# EAGLE board AuxTalon_LoadSwitch (EAGLE 9.6.2)
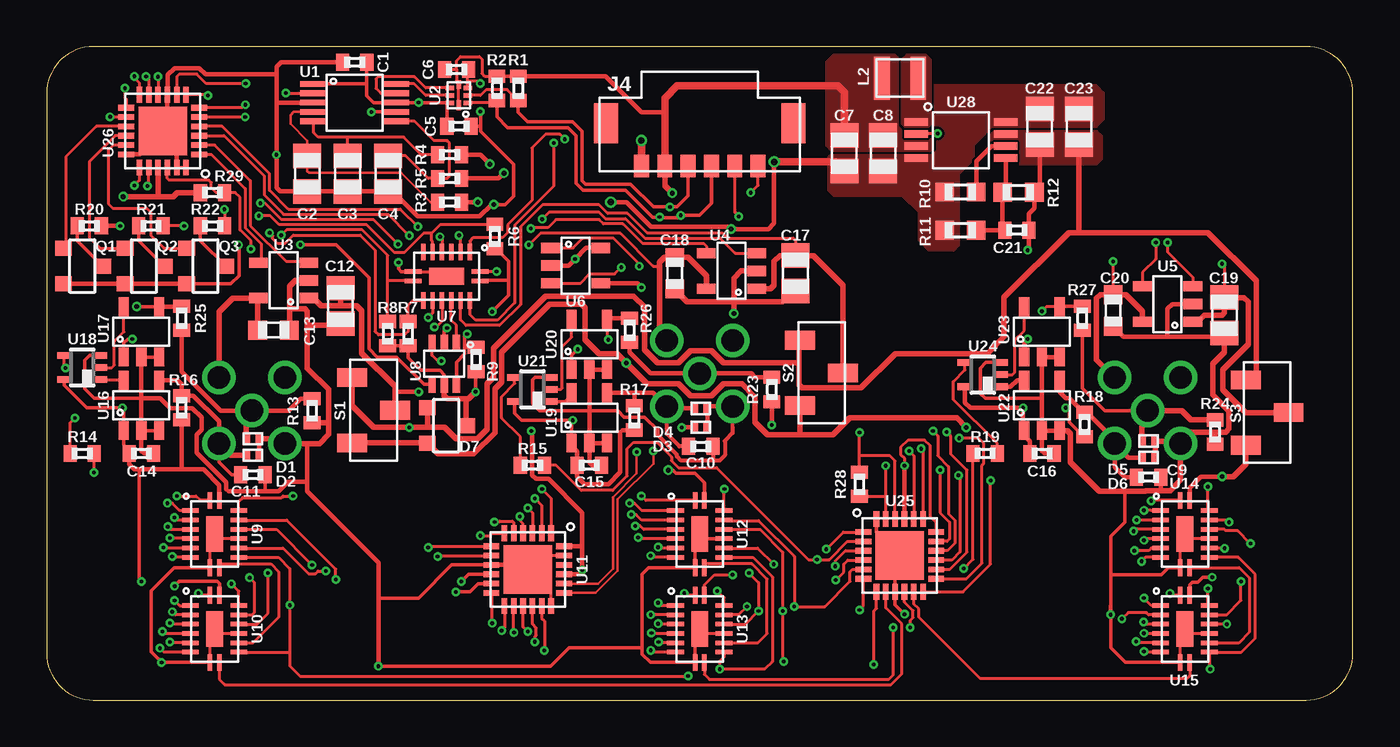
[diagram p2: board, top side]
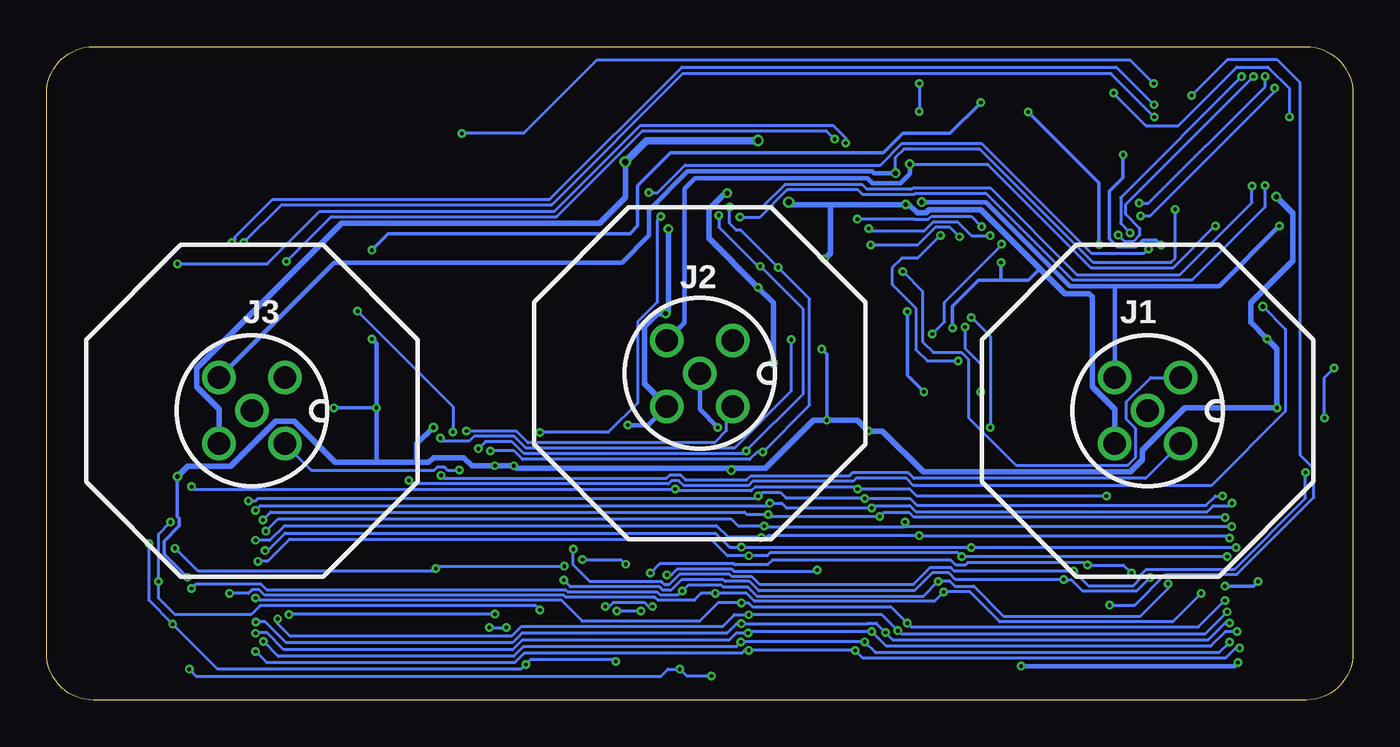
[diagram p3: board, bottom side, seen from below]

Size 70 x 35 mm. Coordinates in mm from the lower left corner, seen from the top.
Outline: 0,32.5 0,2.5 arc90 2.5,0 67.5,0 arc90 70,2.5 70,32.5 arc90 67.5,35 2.5,35 arc90 0,32.5
Copper layers (1*16): Top 0.035559375mm / dielectric 1.6mm / Bottom 0.035559375mm
Design rules "jlcpcb-2layer": minimum track width 5mil, minimum drill 0.2mm, track to track 5mil, track to pad 6mil, pad to pad 5mil, via to via 6mil, smd to smd 5mil, copper to edge 15mil, drill to drill 6mil, minimum pad ring 5mil, minimum via ring 5mil, stop-mask expansion 2.5mil, vias tented up to drill 0mil, thermal gap 10mil

## Footprints (pad centres in the part's own frame; a part is rotated, then mirrored left to right if it is on the bottom)
C0402 = smd 0.7 x 0.9: 1 -0.65,0; 2 0.65,0
C0805 = smd 1.3 x 1.5: 1 -0.95,0; 2 0.95,0
C0603 = smd 1 x 1: 1 -0.85,0; 2 0.85,0
D0402 = smd 0.4 x 0.7: 1 -0.35,0; 2 0.35,0
SOT23-3 = smd 0.8 x 0.9: 1 -0.95,-1; 2 0.95,-1; 3 0,1.1
1X05_M12_TE_T41410 = drill 1.2: 1 1.768,1.768; 2 -1.768,1.768; 3 -1.768,-1.768; 4 1.768,-1.768; 5 0,0
1X06_MICROLOCKPLUS = smd 0.8 x 1.2: 1 -3.125,-0.6; 2 -1.875,-0.6; 3 -0.625,-0.6; 4 0.625,-0.6; 5 1.875,-0.6; 6 3.125,-0.6 | smd 1.3 x 2.15: BODY@1 -5.025,1.695; BODY@2 5.025,1.695
WE-MAPI(2.5X2) = smd 0.85 x 2.3: P$1 -0.975,0; P$2 0.975,0
R0402 = smd 0.7 x 0.9: 1 -0.65,0; 2 0.65,0
R0603 = smd 1 x 1: 1 -0.85,0; 2 0.85,0
CAS-120A1 = smd 1 x 1.6: 1 -1.75,-1.15; 2 0,1.15; 3 1.75,-1.15
VSSOP_10 = smd 0.3 x 1.45: 1 -1,-2.2; 2 -0.5,-2.2; 3 0,-2.2; 4 0.5,-2.2; 5 1,-2.2; 6 1,2.2; 7 0.5,2.2; 8 0,2.2; 9 -0.5,2.2; 10 -1,2.2
UQFN-8_1.4X1.2 = smd 0.55 x 0.25: 1 -0.53,0 | smd 0.25 x 0.45: 2 -0.4,-0.475; 3 0,-0.475; 4 0.4,-0.475; 6 0.4,0.475; 7 0,0.475; 8 -0.4,0.475 | smd 0.45 x 0.25: 5 0.58,0
SOT23-5 = smd 0.55 x 1: 1 -0.95,-1.35; 2 0,-1.35; 3 0.95,-1.35; 4 0.95,1.35; 5 -0.95,1.35
VQFN-16 = smd 0.9 x 0.24: 1 -1.8,-0.25; 8 1.8,-0.25; 9 1.8,0.25; 16 -1.8,0.25 | smd 0.24 x 0.9: 2 -1.25,-1.3; 3 -0.75,-1.3; 4 -0.25,-1.3; 5 0.25,-1.3; 6 0.75,-1.3; 7 1.25,-1.3; 10 1.25,1.3; 11 0.75,1.3; 12 0.25,1.3; 13 -0.25,1.3; 14 -0.75,1.3; 15 -1.25,1.3 | smd 1.9 x 0.9: EP 0,0
DCK_R-PDSO-G6 = smd 0.4 x 0.9: 1 -0.65,-1.1; 2 0,-1.1; 3 0.65,-1.1; 4 0.65,1.1; 5 0,1.1; 6 -0.65,1.1
QFN24 = smd 0.85 x 0.3: 1 -1.95,1.25; 2 -1.95,0.75; 3 -1.95,0.25; 4 -1.95,-0.25; 5 -1.95,-0.75; 6 -1.95,-1.25; 13 1.95,-1.25; 14 1.95,-0.75; 15 1.95,-0.25; 16 1.95,0.25; 17 1.95,0.75; 18 1.95,1.25 | smd 0.3 x 0.85: 7 -1.25,-1.95; 8 -0.75,-1.95; 9 -0.25,-1.95; 10 0.25,-1.95; 11 0.75,-1.95; 12 1.25,-1.95; 19 1.25,1.95; 20 0.75,1.95; 21 0.25,1.95; 22 -0.25,1.95; 23 -0.75,1.95; 24 -1.25,1.95 | smd 2.6 x 2.6: EP 0,0
DCK_R-PDSO-G5 = smd 0.35 x 0.8: 1 -0.65,-0.95; 2 0,-0.95; 3 0.65,-0.95; 4 0.65,0.95; 5 -0.65,0.95
MSOP_8 = smd 1.26 x 0.4: 1 -2.4,0.975; 2 -2.4,0.325; 3 -2.4,-0.325; 4 -2.4,-0.975; 5 2.4,-0.975; 6 2.4,-0.325; 7 2.4,0.325; 8 2.4,0.975

## Placement (x,y rotation side)
C1  0.1uF  [C0402]  16.51,34.16 180 top
C2  0.1uF  [C0805]  13.97,28.19 270 top
C3  0.1uF  [C0805]  16.13,28.19 270 top
C4  0.1uF  [C0805]  18.29,28.19 270 top
C5  0.1uF  [C0402]  22.1,30.73 0 top
C6  0.1uF  [C0402]  21.97,33.78 0 top
C7  10uF  [C0805]  42.75,29.29 270 top
C8  10uF  [C0805]  44.83,29.29 270 top
C9  47nF  [C0402]  59.05,11.94 0 top
C10  47nF  [C0402]  35.05,13.59 0 top
C11  47nF  [C0402]  11.05,12.06 0 top
C12  10uF  [C0805]  15.75,21.11 270 top
C13  10uF  [C0603]  12.16,19.81 0 top
C14  0.1uF  [C0402]  5.08,13.21 0 top
C15  0.1uF  [C0402]  29.08,12.57 0 top
C16  0.1uF  [C0402]  53.34,13.21 0 top
C17  10uF  [C0805]  40.13,22.86 270 top
C18  10uF  [C0603]  33.66,22.86 270 top
C19  10uF  [C0805]  63.12,20.61 270 top
C20  10uF  [C0603]  57.15,20.86 270 top
C21  [C0402]  52,25.17 180 top
C22  22uF  [C0805]  53.22,30.7 90 top
C23  22uF  [C0805]  55.33,30.7 90 top
D1  6V  [D0402]  11.05,14 180 top
D2  6V  [D0402]  11.05,13.11 180 top
D3  6V  [D0402]  35.05,14.61 180 top
D4  6V  [D0402]  35.05,15.62 180 top
D5  6V  [D0402]  59.05,13.88 180 top
D6  6V  [D0402]  59.05,12.99 180 top
D7  [SOT23-3]  21.41,14.7 270 top
J1  CONN_AUX_M12_REMOTE  [1X05_M12_TE_T41410]  11,15.5 90 top
J2  CONN_AUX_M12_REMOTE  [1X05_M12_TE_T41410]  35,17.5 90 top
J3  CONN_AUX_M12_REMOTE  [1X05_M12_TE_T41410]  59,15.5 90 top
J4  CONN_TALON_REMOTE  [1X06_MICROLOCKPLUS]  35,29.21 0 top
L2  4.7uH  [WE-MAPI(2.5X2)]  45.73,33.31 0 top
Q1  2N7002  [SOT23-3]  1.91,23.24 270 top
Q2  2N7002  [SOT23-3]  5.21,23.24 270 top
Q3  2N7002  [SOT23-3]  8.51,23.24 270 top
R1  10k  [R0402]  25.27,32.77 90 top
R2  10k  [R0402]  24.13,32.77 90 top
R3  10k  [R0402]  21.59,26.67 0 top
R4  10k  [R0402]  21.59,29.21 0 top
R5  10k  [R0402]  21.59,27.94 0 top
R6  100k  [R0402]  24.02,24.83 270 top
R7  100k  [R0402]  19.37,19.63 270 top
R8  100k  [R0402]  18.28,19.63 270 top
R9  100k  [R0402]  23.01,18.24 270 top
R10  100k  [R0603]  48.97,27.22 0 top
R11  100k  [R0603]  48.97,25.17 0 top
R12  750k  [R0603]  52.08,27.2 0 top
R13  100k  [R0402]  14.22,15.49 90 top
R14  1k  [R0402]  1.91,13.21 0 top
R15  1k  [R0402]  26.04,12.57 0 top
R16  10k  [R0402]  7.24,15.65 270 top
R17  10k  [R0402]  31.5,15.11 270 top
R18  10k  [R0402]  55.63,14.76 270 top
R19  1k  [R0402]  50.29,13.21 180 top
R20  10k  [R0402]  2.29,25.4 0 top
R21  10k  [R0402]  5.59,25.4 0 top
R22  10k  [R0402]  8.89,25.4 0 top
R23  100k  [R0402]  38.86,16.64 90 top
R24  100k  [R0402]  62.61,14.35 90 top
R25  1k  [R0402]  7.24,20.45 90 top
R26  1k  [R0402]  31.24,19.81 90 top
R27  1k  [R0402]  55.5,20.45 90 top
R28  100k  [R0402]  43.56,11.56 270 top
R29  100k  [R0402]  8.89,27.18 180 top
S1  SPDTCAS-120A1  [CAS-120A1]  17.53,15.53 270 top
S2  SPDTCAS-120A1  [CAS-120A1]  41.53,17.53 270 top
S3  SPDTCAS-120A1  [CAS-120A1]  65.41,15.4 270 top
U1  ADS1115  [VSSOP_10]  16.51,32 270 top
U2  FXMAR2102UMLP  [UQFN-8_1.4X1.2]  22.09,32.39 90 top
U3  MIC2090-2  [SOT23-5]  12.7,22.48 90 top
U4  MIC2090-2  [SOT23-5]  36.7,22.99 90 top
U5  MIC2090-2  [SOT23-5]  60.07,21.21 90 top
U6  AT24MAC602SOT23  [SOT23-5]  28.35,23.27 270 top
U7  74HC4852  [VQFN-16]  21.43,22.7 180 top
U8  SN74LVC1G3157SC70  [DCK_R-PDSO-G6]  21.31,18.01 180 top
U9  [VQFN-16]  9,8.89 270 top
U10  [VQFN-16]  9,3.81 270 top
U11  PCAL9535AQFN  [QFN24]  25.78,6.99 270 top
U12  [VQFN-16]  35,8.89 270 top
U13  [VQFN-16]  35,3.81 270 top
U14  [VQFN-16]  61,8.89 270 top
U15  [VQFN-16]  61,3.81 270 top
U16  MAX9064  [SOT23-5]  5.08,15.78 0 top
U17  MAX9064  [SOT23-5]  5.08,19.72 0 top
U18  SN74AUP1T87  [DCK_R-PDSO-G5]  1.91,17.81 90 top
U19  MAX9064  [SOT23-5]  29.08,15.11 0 top
U20  MAX9064  [SOT23-5]  29.08,19.05 0 top
U21  SN74AUP1T87  [DCK_R-PDSO-G5]  26.04,16.64 90 top
U22  MAX9064  [SOT23-5]  53.34,15.78 0 top
U23  MAX9064  [SOT23-5]  53.34,19.72 0 top
U24  SN74AUP1T87  [DCK_R-PDSO-G5]  50.16,17.43 90 top
U25  PCAL9535AQFN  [QFN24]  45.72,7.75 0 top
U26  PCAL9535AQFN  [QFN24]  6.22,30.48 180 top
U28  PAM2401MSOP  [MSOP_8]  49,30 0 top

## Tracks (layer width: path | path; a pad name or v marks a point on that pad's centre or on a via)
3V3  (via drill 0.2, 0.25)
  Top 0.152: 21.96,33.78 21.96,34.24 22.18,34.46 23.19,34.46 23.33,34.33 23.33,33.57 23.48,33.42 R2.2 | C6.1 21.96,33.78 | U13.16 35.25,6.17 35.79,6.71 v36.76,6.71 | U2.1 U2.5 22.09,33.07 21.96,33.19 21.96,33.78 | U25.23 44.97,10.92 | 44.97,10.92 44.97,12.54 v44.96,12.55 | U25.18 47.67,9.51 47.35,9.83 47.35,13.62 47.05,13.92 46.16,13.92 45.77,13.53 45.77,13.15 45.97,12.95 v45.97,12.55 | R28.2 43.58,10.92 44.97,10.92
  Top 0.2: U17.1 4.13,19.13 4.33,19.34 v4.59,19.34 | C14.1 4.43,13.38 4.13,13.68 U16.1 4.13,15.59 v4.06,15.65 2.16,15.65 0.95,16.86 U18.5 | v6.86,6.1 7.11,6.35 9.14,6.35 9.27,6.22 9.27,5.63 U10.16 | 4.95,12.35 4.95,6.48 v5.08,6.35 | U15.16 61.25,6.17 61.4,6.32 61.7,6.32 61.96,6.58 v62.47,6.58 | U20.1 28.13,18.47 v28.46,18.8 | U19.1 28.13,14.93 v28.19,14.99 25.45,14.99 25.09,15.35 U21.5 | R2.2 R1.2 | v54.61,15.65 54.82,15.45 54.82,14.89 55.59,14.11 R18.2 | U12.16 35.25,11.64 34.75,12.14 33.73,12.14 33.56,12.31 v33.31,12.31
  Top 0.254: R16.2 7.24,12.35 | C14.1 4.43,12.62 4.7,12.35 4.95,12.35 7.24,12.35 | U19.1 28.13,13.64 28.43,13.34 C15.1 28.43,11.95 28.83,11.56 30.1,11.56 30.73,12.19 30.73,14.34 30.86,14.46 R17.2 | C16.1 52.69,13.88 52.39,14.18 U22.1 52.32,14.5 v52.32,15.65 49.5,15.65 49.22,15.94 U24.5 | v52.58,19.34 52.39,19.15 U23.1 | v62.99,11.97 61.85,11.97 61.25,11.37 U14.16 | 28.7,8.26 v28.7,6.96 28.7,6.86 28.57,6.73 U11.21 | 28.7,8.26 28.7,10.03 26.89,11.84 26.22,11.84 26.01,12.05 26.01,14.41 v25.97,14.41 | U9.16 9.25,11.51 8.41,12.35 7.24,12.35 | R1.2 29.96,33.42 31.88,31.5 33.12,31.5 | U6.4 31.66,22.32 v31.88,22.1 | v45.97,12.55 U25.21 | U11.24 28.68,8.23 28.7,8.26
  Top 0.305: v62.99,11.97 63.59,11.97 64.25,12.63 S3.3 | v33.53,27.15 33.12,27.56 J4.2 | S1.3 20.38,13.78 D7.2 20.97,13.18 22.88,13.18 24.03,14.33 24.03,16.66 24.38,17.01 24.38,18.64 26.95,21.21 28.66,21.21 28.84,21.03 28.84,19.29 29.59,18.54 30.57,18.54 v31.06,18.06 32.18,16.94 33.86,16.94 34.5,16.3 35.63,16.3 36.27,16.94 37.27,16.94 37.97,16.23 37.97,14.87 38.64,14.2 40.39,14.2 | v49.28,14.61 48.77,15.11 43.05,15.11 42.14,14.2 40.39,14.2 | S2.3 40.38,14.21 40.39,14.2 | R29.2 6.99,27.18 6.77,26.96 5.97,26.96 | v4.1,26.96 5.97,26.96 | U26.21 5.97,26.97 5.97,26.96
  Top 0.406: J4.2 33.12,31.5 33.12,32.24 33.78,32.89 42.42,32.89 42.75,32.56 C7.1
  Bottom 0.152: v36.76,6.71 36.51,6.71 36.21,7.01 33.28,7.01 33.18,6.91 28.75,6.91 v28.7,6.96
  Bottom 0.2: v6.86,6.1 5.33,6.1 v5.08,6.35 | v28.46,18.8 28.19,18.53 v28.19,14.99 | v62.47,6.58 63.7,7.82 63.7,8.52 62.89,9.33 62.89,9.72 62.99,9.82 v62.99,11.97 | v54.61,15.65 v52.32,15.65
  Bottom 0.254: v52.58,19.34 52.32,19.08 v52.32,15.65 52.32,12.73
  Bottom 0.305: v49.28,14.61 50.16,13.72 50.16,12.73 | v31.06,18.06 31.06,21.28 v31.88,22.1 34.51,24.73 34.51,26.3 33.66,27.15 v33.53,27.15 | 33.4,12.42 31.48,12.42 28.91,14.99 v28.19,14.99 26.54,14.99 v25.97,14.41 25.2,14.41 23.02,12.22 11.92,12.22 11.28,12.86 11.28,13.38 9.02,15.65 v4.06,15.65 4.06,18.81 v4.59,19.34 5.47,20.23 5.47,21.27 3.21,23.54 3.21,26.07 v4.1,26.96 | 33.4,12.42 44.83,12.42 v44.96,12.55 v45.97,12.55 47.21,12.55 47.65,12.99 49.28,12.99 49.53,12.73 50.16,12.73 | v33.31,12.31 33.31,12.33 33.4,12.42 | 50.16,12.73 52.32,12.73 54.53,12.73 56.73,14.94 57.73,14.94 60.14,12.53 62.43,12.53 v62.99,11.97
  pour Top (no thermals): 41.78,34.16 41.78,29.72 42.04,29.46 47.37,29.46 47.5,29.59 47.5,30.23 47.37,30.35 45.97,30.35 45.59,30.73 45.59,34.42 45.34,34.67 42.29,34.67
5V  (via drill 0.2)
  Top 0.152: U7.11 20.68,20.73 v20.45,20.49
  Top 0.2: C1.1 17.16,33.02 | 17.16,33.02 17.16,32.37 17.53,32 U1.8 v19.94,32 21.46,32 | 17.16,33.02 17.14,33 U1.1 | U2.8 21.6,32 21.46,32 | C5.1 21.45,31.99 21.46,32
  Top 0.254: C22.1 53.22,27.49 R12.2 52.93,26.34 52.65,26.06 C21.1 52.65,24.17 v52.58,24.1
  Top 0.305: S1.1 16.38,15.76 17.53,14.61 v19.43,14.61 20.45,14.61 | C23.1 55.33,25.04 | 20.45,14.61 21.32,14.61 21.93,13.99 23.08,13.99 23.6,14.51 23.6,16.94 23.95,17.3 23.95,18.84 26.75,21.64 31.45,21.64 32.03,21.06 32.03,18.77 32.73,18.06 33.86,18.06 34.5,18.7 35.63,18.7 36.27,18.06 40.27,18.06 40.3,18.03 | D7.1 20.41,14.65 20.45,14.61 | 40.3,18.03 40.3,16.9 40.48,16.72 43.65,16.72 45.48,18.56 50.41,18.56 51.31,19.46 51.31,21.57 54.78,25.04 55.33,25.04 | 55.33,25.04 62.23,25.04 64.82,22.45 64.82,17.46 64.51,17.15 S3.1 | S2.1 40.3,19.2 40.3,18.03
  Bottom 0.152: v20.45,20.49 19.43,19.48 v19.43,14.61
  Bottom 0.2: v52.58,24.1 51.69,24.99 38.74,24.99 38.33,25.4 38.33,27.54 36.55,29.31 25.15,29.31 24.11,30.35 21.59,30.35 v19.94,32
  pour Top (no thermals): 50.8,30.48 56.26,30.48 56.52,30.23 56.52,28.96 56.26,28.7 50.8,28.7 50.55,28.96 50.55,30.23
5V_EN  (via drill 0.2)
  Top 0.152: v47.75,30.35 47.72,30.32 U28.2 | v10.67,33.02 8.55,33.02 8.04,33.53 7.11,33.53 6.97,33.39 U26.8
  Bottom 0.152: v47.75,30.35 44.45,30.35 40.51,34.29 11.94,34.29 v10.67,33.02
!OVF1
  Top 0.152: U10.9 9.25,1.12 9.55,0.82 45.25,0.82 45.83,1.4 45.83,4.08 44.97,4.94 U25.8
!OVF2  (via drill 0.2)
  Top 0.152: v45.37,3.88 45.37,1.34 45.13,1.1 35.52,1.1 35.25,1.38 U13.9 | v46.28,3.88 46.28,4.26 46.43,4.41 46.43,4.79 45.97,5.25 U25.10
  Bottom 0.152: v46.28,3.88 v45.37,3.88
!OVF3
  Top 0.152: U15.9 61.25,1.31 61.09,1.14 50.04,1.14 46.74,4.45 46.74,4.88 46.47,5.14 U25.11
!PORT1_FAULT
  Top 0.152: U26.1 8.81,29.23 10.64,27.4 10.64,25.3 11.49,24.45 11.49,23.57 U3.4
!PORT2_FAULT  (via drill 0.2)
  Top 0.152: v25.94,25.25 25.99,25.3 26.87,25.3 27.3,25.73 29.61,25.73 29.83,25.51 30.89,25.51 31.94,24.46 35.21,24.46 35.35,24.32 U4.4 | v19.43,24.87 18.29,26.02 12.7,26.02 11.66,27.06 11.66,28.08 9.51,30.23 U26.3
  Bottom 0.152: v19.43,24.87 20.45,24.87 21.2,25.63 22.47,25.63 22.95,25.15 25.84,25.15 v25.94,25.25
!PORT3_FAULT  (via drill 0.2)
  Top 0.152: v10.64,31.23 U26.5 | v59.44,24.51 59.44,23.62 58.72,22.91 U5.4
  Bottom 0.152: v59.44,24.51 57.4,26.54 42.93,26.54 35.92,33.55 12.96,33.55 v10.64,31.23
!RST  (via drill 0.2)
  Top 0.152: U9.10 12.43,7.64 13.03,7.04 v13.03,5.08 13.03,2.54 | 13.03,2.54 13.03,1.83 13.58,1.28 v34.37,1.28 | U12.10 37.84,7.64 38.89,6.59 38.89,2.06 38.48,1.65 v36.07,1.65 36.07,2.07 36.3,2.31 U13.10 | 13.03,2.54 13.01,2.56 U10.10 | v62.36,1.65 62.3,1.71 U15.10 64.03,2.56 64.77,3.3 64.77,6.73 63.86,7.64 U14.10 | v8.64,32.38 8.59,32.43 U26.7
  Bottom 0.152: v34.37,1.28 35.7,1.28 v36.07,1.65 36.7,1.65 37.08,1.27 61.98,1.27 v62.36,1.65 | v13.03,5.08 11.69,5.08 10.05,6.73 6.22,6.73 2.08,10.86 2.08,12.38 2.82,13.12 2.82,33.07 4.04,34.29 6.73,34.29 v8.64,32.38
ACTRL1
  Top 0.152: U26.15 2.66,30.73 1.03,29.1 1.03,24.32 Q1.1
ACTRL2
  Top 0.152: U26.16 3.67,30.23 2.29,28.84 2.29,24.77 2.86,24.19 Q2.1
ACTRL3
  Top 0.152: U26.17 3.57,29.73 3.3,29.46 3.3,26.59 3.54,26.35 5.36,26.35 5.59,26.13 5.59,24.89 6.29,24.19 Q3.1
ADC_INT  (via drill 0.2)
  Top 0.152: v12.83,32.51 14.3,32.51 U1.2 | v3.4,31.24 4.26,31.24 U26.14
  Bottom 0.152: v3.4,31.24 3.4,32.76 4.55,33.91 6.22,33.91 9.36,30.77 11.09,30.77 v12.83,32.51
AIN1  (via drill 0.2, 0.25)
  Top 0.254: R3.2 v23.11,26.67 | v3.94,25.4 R20.2
  Bottom 0.254: v23.11,26.67 19.66,26.67 15.17,22.18 12.7,22.18 | v3.94,25.4 7.16,22.18 12.7,22.18 | 12.7,22.18 12.77,22.11 J1.4
AIN1_FILT
  Top 0.127: R3.1 20.57,26.67 19,28.24 14.05,28.24 13.97,28.32 C2.1 13.97,29.97 13.08,30.86 13.08,31.34 13.25,31.5 U1.4
AIN2  (via drill 0.2, 0.25)
  Top 0.152: v7.37,25.4 R21.2
  Top 0.254: v23.75,28.7 23.75,28.72 23.26,29.21 R4.2
  Bottom 0.152: v23.75,28.7 19.58,28.7 14.04,23.17 9.63,23.17 7.4,25.4 v7.37,25.4
  Bottom 0.254: J2.4 35.81,20.22 35.81,27.39 35.26,27.94 26,27.94 25.75,27.69 24.26,27.69 23.75,28.19 v23.75,28.7
AIN2_FILT
  Top 0.152: R4.1 20.07,29.21 19.13,30.15 16.13,30.15 | U1.5 14.31,30.39 14.55,30.15 16.13,30.15 | C3.1 16.13,30.15
AIN3  (via drill 0.2, 0.25)
  Top 0.152: v9.53,26.29 9.54,26.27 R22.2
  Top 0.254: v24.51,28.22 24.23,27.94 R5.2
  Bottom 0.152: v24.51,28.22 24.51,29.07 24.04,29.54 20.02,29.54 13.93,23.45 9.75,23.45 9.53,23.67 v9.53,26.29
  Bottom 0.254: J3.4 54.6,23.43 39.18,23.43 37.72,24.89 37.72,26.25 35.65,28.32 25.76,28.32 25.65,28.22 v24.51,28.22
AIN3_FILT
  Top 0.152: C4.1 19.24,29.14 20.45,27.94 R5.1 21.46,27.94 21.59,28.07 21.59,29.84 21.46,29.97 20.76,29.97 19.73,31 U1.6
BUS_SENSE  (via drill 0.2)
  Top 0.2: U8.4 20.22,16.91 18.75,18.37 17.72,18.37 17.28,18.82 17.28,22.62 15.51,24.39 v13.6,24.39 | v17.4,31.5 v17.41,31.5 U1.7
  Bottom 0.2: v13.6,24.39 13.6,27.7 v17.4,31.5
C0  (via drill 0.2)
  Top 0.152: U12.15 36.3,11.28 v36.32,11.3 | U14.15 62.23,10.21 v62.23,11.43 | U9.15 10.3,10.65 10.5,10.85 12.58,10.85 12.66,10.92 v13.21,10.92 | v26.54,11.3 27.03,10.81 U11.1
  Bottom 0.152: v62.23,11.43 62.1,11.3 v36.32,11.3 36.22,11.2 32.24,11.2 32.01,11.43 26.67,11.43 v26.54,11.3 23.75,11.3 23.37,10.92 v13.21,10.92
C1  (via drill 0.2)
  Top 0.152: v6.99,10.92 8.01,10.92 8.24,10.69 U9.1 | U12.1 32.11,10.69 v31.88,10.92 | U14.1 59.2,10.69 v59.18,10.67 | v26.16,10.79 26.53,10.43 U11.2
  Bottom 0.152: v59.18,10.67 58.81,10.67 58.68,10.79 32,10.79 v31.88,10.92 31.68,11.12 30.68,11.12 30.35,10.79 v26.16,10.79 23.73,10.79 23.36,10.42 7.87,10.42 7.37,10.92 v6.99,10.92
C2  (via drill 0.2)
  Top 0.152: U9.2 7.13,10.14 6.73,10.54 v6.48,10.54 | U12.2 31.9,10.14 31.5,10.54 v31.24,10.54 | U14.2 59.2,10.14 59.18,10.16 v58.8,10.16 | v25.78,10.29 26.03,10.04 U11.3
  Bottom 0.152: v6.48,10.54 6.6,10.41 7.48,10.41 7.81,10.09 23.42,10.09 23.75,10.41 25.65,10.41 v25.78,10.29 30.35,10.29 30.61,10.54 v31.24,10.54 31.37,10.41 58.55,10.41 v58.8,10.16
C3  (via drill 0.2)
  Top 0.152: U9.3 6.99,9.64 v6.85,9.77 | U12.3 31.88,9.64 31.59,9.94 v31.33,9.94 | U14.3 v58.42,9.64 v58.41,9.65 | U11.4 25.53,9.44 25.36,9.62 v25.36,9.83
  Bottom 0.152: v58.41,9.65 58,10.06 32.6,10.06 32.47,9.94 v31.33,9.94 31.23,9.83 v25.36,9.83 25.16,10.03 23.76,10.03 23.54,9.81 6.88,9.81 v6.85,9.77
C4  (via drill 0.2)
  Top 0.152: U9.4 6.63,9.14 v6.49,9.28 | U12.4 31.99,9.14 31.8,9.33 v31.55,9.33 | U14.4 58.35,9.14 v58.25,9.04 | v24,9.54 24.23,9.54 24.29,9.59 24.95,9.59 25.03,9.51 U11.5
  Bottom 0.152: v58.25,9.04 57.58,9.71 33.33,9.71 32.94,9.33 v31.55,9.33 31.5,9.28 24,9.28 | v6.49,9.28 24,9.28 | v24,9.54 24,9.28
C5  (via drill 0.2)
  Top 0.152: U9.5 7.66,8.68 v6.6,8.68 | U12.5 31.76,8.64 v31.69,8.71 | U14.5 58.88,8.64 v58.8,8.56 | v23.24,8.8 23.75,8.8 23.88,8.94 U11.6
  Bottom 0.152: v6.6,8.68 6.73,8.8 v23.24,8.8 31.33,8.8 31.43,8.71 v31.69,8.71 33.47,8.71 34.11,9.35 57.25,9.35 58.04,8.56 v58.8,8.56
C6  (via drill 0.2)
  Top 0.152: U9.6 6.28,8.14 v6.26,8.16 | U14.6 59.19,8.14 59.05,8 v58.29,8 | v20.45,8.16 20.52,8.23 U11.7 | U12.6 32.81,8.14 v32.77,8.18
  Bottom 0.152: v6.26,8.16 v20.45,8.16 20.47,8.18 v32.77,8.18 33.4,8.18 34.16,8.95 57.22,8.95 58.17,8 v58.29,8
C7  (via drill 0.2)
  Top 0.152: U9.7 6.78,7.64 v6.73,7.68 | U12.7 32.45,7.64 v32.37,7.73 | U14.7 58.88,7.64 v58.67,7.43 | v20.95,7.68 21.01,7.74 U11.8
  Bottom 0.152: v6.73,7.68 v20.95,7.68 21.16,7.88 31.23,7.88 31.39,7.73 v32.37,7.73 33.51,7.73 34.4,8.62 56.98,8.62 58.17,7.43 v58.67,7.43
C8  (via drill 0.2)
  Top 0.152: U13.15 36.3,5.48 v35.94,5.84 | U10.15 10.3,5.83 v9.91,6.22 | U15.15 62.23,5.13 v62.23,5.97
  Top 0.2: U11.10 22.61,6.74 v22.23,6.35
  Bottom 0.152: v9.91,6.22 9.91,5.97 11.4,4.47 18.69,4.47 20.32,6.1 21.34,6.1 21.59,6.35 v22.23,6.35 23.01,5.57 31.94,5.57 32.45,6.07 33.76,6.07 33.86,6.17 35.61,6.17 v35.94,5.84 36.17,5.61 37.1,5.61 37.27,5.78 42.07,5.78 42.18,5.89 58.19,5.89 58.5,6.2 62,6.2 v62.23,5.97
C9  (via drill 0.2)
  Top 0.152: U13.1 34.27,5.61 v34.16,5.71 | U10.1 8.23,5.61 v8.13,5.71 | U15.1 60.3,5.61 v60.2,5.71
  Top 0.2: U11.11 23.13,6.24 22.68,5.79 v21.93,5.79
  Bottom 0.152: v8.13,5.71 9.65,4.19 18.92,4.19 20.52,5.79 v21.93,5.79 22.43,5.29 32.06,5.29 32.49,5.71 v34.16,5.71 34.92,5.71 35.31,5.33 37.22,5.33 37.39,5.5 42.18,5.5 42.29,5.61 58.31,5.61 58.61,5.92 58.99,5.92 59.19,5.71 v60.2,5.71
C10  (via drill 0.2)
  Top 0.152: U10.2 7.13,5.06 v6.86,5.33 | U13.2 32.91,5.06 v32.77,5.21 | U15.2 59.2,5.06 v58.8,5.46 | U11.12 23.83,4.16 v23.88,4.12
  Bottom 0.152: v58.8,5.46 58.67,5.46 58.55,5.33 42.41,5.33 41.29,4.21 35.02,4.21 34.03,5.21 v32.77,5.21 32.38,5.21 32.18,5.01 24.77,5.01 v23.88,4.12 23.67,3.91 8.28,3.91 v6.86,5.33
C11  (via drill 0.2)
  Top 0.152: U10.3 6.9,4.56 v6.73,4.73 | U13.3 v32.39,4.56 v32.38,4.57 | U15.3 59.06,4.56 58.94,4.69 57.96,4.69 v57.62,4.35 | U11.13 24.53,3.86 v24.38,3.71
  Bottom 0.152: v6.73,4.73 7.9,3.56 24.23,3.56 v24.38,3.71 25.24,4.57 v32.38,4.57 33.14,4.57 33.78,3.93 44.57,3.93 45.08,3.42 56.95,3.42 57.62,4.09 v57.62,4.35
C12  (via drill 0.2)
  Top 0.152: U10.4 6.67,4.06 v6.6,4.12 | U13.4 32.79,4.06 v32.77,4.09 | U15.4 58.91,4.06 v58.79,4.18 | v25.05,3.61 25.03,3.63 U11.14
  Bottom 0.152: v6.6,4.12 6.86,4.12 7.75,3.23 24.67,3.23 v25.05,3.61 25.55,4.12 25.97,4.12 26,4.09 v32.77,4.09 33.02,4.09 33.53,3.58 44.53,3.58 45.04,3.07 57.17,3.07 58.28,4.18 v58.79,4.18
C13  (via drill 0.2)
  Top 0.152: U10.5 6.31,3.56 v6.2,3.66 | U13.5 32.44,3.56 v32.41,3.58 | U15.5 58.82,3.56 v58.8,3.58 | v25.78,3.66 25.53,3.91 U11.15
  Bottom 0.152: v6.2,3.66 6.84,3.66 7.6,2.9 25.02,2.9 v25.78,3.66 32.33,3.66 v32.41,3.58 33.05,3.58 33.43,3.2 44.51,3.2 45.02,2.69 57.3,2.69 58.19,3.59 58.78,3.59 v58.8,3.58
C14  (via drill 0.2)
  Top 0.152: U10.6 6.65,3.06 v6.6,3.1 | U13.6 32.84,3.06 v32.79,3.1 | U15.6 58.46,3.06 v58.38,3.14 | U11.16 26.03,4.06 26.24,3.85 26.24,3.48 26.16,3.4 v26.16,3.12
  Bottom 0.152: v58.38,3.14 57.59,2.34 44.98,2.34 44.47,2.85 33.05,2.85 v32.79,3.1 32.58,3.1 32.57,3.12 v26.16,3.12 25.59,2.55 7.16,2.55 v6.6,3.1
C15  (via drill 0.2)
  Top 0.152: U10.7 6.29,2.56 v6.08,2.77 | U13.7 32.48,2.56 v32.38,2.66 | U15.7 58.84,2.56 v58.8,2.6 | U11.17 26.53,4.38 26.67,4.24 v26.67,2.65
  Bottom 0.152: v6.08,2.77 6.29,2.77 6.8,2.27 26.29,2.27 v26.67,2.65 26.68,2.66 v32.38,2.66 32.59,2.66 32.73,2.52 44.4,2.52 44.91,2.01 58.21,2.01 v58.8,2.6
COUNT_EN1  (via drill 0.2)
  Top 0.152: v10.88,6.55 11.13,6.3 11.13,4.69 11,4.56 U10.14 | v15.49,6.45 15.49,7.02 12.87,9.64 U9.14 | v42.29,6.42 v42.29,6.43 42.72,6.85 42.72,7.29 42.93,7.5 U25.4
  Bottom 0.152: v10.88,6.55 11.59,5.84 14.49,5.84 15.1,6.45 v15.49,6.45 21.3,6.45 21.65,6.81 22.54,6.81 23.5,5.84 31.83,5.84 32.33,6.35 33.64,6.35 33.74,6.45 35.98,6.45 36.53,5.89 36.98,5.89 37.15,6.06 41.93,6.06 v42.29,6.42
COUNT_EN2  (via drill 0.2)
  Top 0.152: U12.14 36.32,9.62 38.15,9.62 40.07,7.7 v40.07,5 41.71,5 43.05,6.35 43.05,6.86 43.19,7 U25.5 | v37.53,5 37.09,4.56 U13.14
  Bottom 0.152: v40.07,5 39.85,5 39.63,5.22 37.96,5.22 37.74,5 v37.53,5
COUNT_EN3  (via drill 0.2)
  Top 0.152: U15.14 63.23,4.56 64.01,5.33 v64.01,6.35 | v63.37,9.53 63.26,9.64 U14.14 | v43.56,4.83 43.77,5.04 U25.6
  Bottom 0.152: v63.37,9.53 64.01,8.89 v64.01,6.35 64.01,5.46 63.12,4.57 59.05,4.57 58.56,5.05 43.79,5.05 v43.56,4.83
D1
  Top 0.254: R13.2 13.6,16.14 12.96,15.5 J1.5 9.33,15.5 7.24,17.59 R25.1
  Top 0.305: D1.2 10.7,15.2 J1.5
D1_SENSE  (via drill 0.2, 0.25)
  Top 0.152: U25.12 49.1,5.8 50.59,7.28 v50.59,11.76
  Top 0.2: U17.4 4.84,21.07 v4.83,21.08
  Top 0.254: R25.2 7.21,21.07 U17.4
  Bottom 0.152: v4.83,21.08 3.61,19.86 3.61,15.46 7.58,11.49 23.54,11.49 23.94,11.89 26.61,11.89 26.77,11.72 32.16,11.72 32.4,11.48 35.85,11.48 36.13,11.76 36.51,11.76 36.69,11.58 50.41,11.58 v50.59,11.76
D2  (via drill 0.2)
  Top 0.254: D3.2 v34.04,14.61 | R23.2 37.97,17.29 37.76,17.5 J2.5 32.37,17.5 31.24,18.63 R26.1
  Bottom 0.254: v34.04,14.61 35,15.57 J2.5
D2_SENSE  (via drill 0.2)
  Top 0.152: U20.4 30.03,19.37 v30.1,19.3 | U25.13 49.3,6.5 50.13,7.33 50.13,12.58 50.22,12.66 50.22,13.75 49.95,14.03 v48.9,14.03
  Top 0.254: R26.2 30.09,20.46 U20.4
  Bottom 0.152: v30.1,19.3 30.1,16.55 33.15,13.5 44.32,13.5 44.94,14.12 47.1,14.12 47.33,13.9 48.77,13.9 v48.9,14.03
D3
  Top 0.2: J3.5 56.7,15.5 55.5,16.7 R27.1
  Top 0.305: D5.2 58.7,15.21 J3.5 60.83,15.5 61.33,15 R24.2
D3_SENSE  (via drill 0.2)
  Top 0.152: U23.4 53.58,21.07 v53.34,20.83 | U25.14 48.4,7 49.32,7.92 49.32,12.32 48.44,13.2 48.44,14.15 v48.23,14.35
  Top 0.2: R27.2 54.32,21.1 U23.4
  Bottom 0.152: v53.34,20.83 48.23,15.72 v48.23,14.35
GND  (via drill 0.2, 0.25, 0.35)
  Top 0.152: U9.12 9.25,8.64 U9.EP 8.75,8.64 U9.8 | U10.8 8.75,3.56 U10.EP 9.25,3.56 U10.12 | U13.12 35.25,3.56 35.15,3.66 U13.EP | U15.8 60.75,3.56 U15.EP 61.25,3.56 U15.12 | U14.8 60.75,8.64 U14.EP 61.25,8.64 U14.12 | U2.4 22.56,33.15 | 22.56,33.15 22.56,33.72 C6.2 | v23.23,33.02 23.11,33.15 22.56,33.15 | v57.01,4.57 57.01,5.07 57.02,5.08 | U7.8 21.18,22.95 U7.EP | U11.23 26.53,7.74 U11.EP 25.91,6.86 27.03,5.74 U11.18 | U26.23 U26.24
  Top 0.2: U17.2 5.21,18.37 U17.3 | U16.2 U16.3 | U18.3 2.3,18.46 2.03,18.19 2.03,16.67 2.54,16.16 5.08,16.16 | U9.8 6.84,7.09 5.6,5.85 5.6,2.58 v6.16,2.01 U10.8 | 34.9,8.79 34.75,8.64 U12.8 32.26,7.09 31.9,6.73 31.9,2.79 | 34.9,8.79 U12.EP | U12.12 35.05,8.64 34.9,8.79 | 35.15,3.66 34.75,3.25 U13.8 32.35,2.01 31.9,2.46 31.9,2.79 | U14.8 60.12,7.09 59.73,6.71 57.05,6.71 57.02,6.73 | U15.8 57.81,2.01 57.02,2.79 57.02,5.08 57.02,6.73 | J2.3 36.77,14.59 | 32.76,14.45 32.05,15.16 30.94,15.16 30.61,15.49 29.08,15.49 26.42,15.49 26.04,15.88 26.04,17.14 26.18,17.29 U21.3 | 53.34,16.16 50.3,16.16 50.04,16.42 50.04,17.78 50.34,18.08 U24.3 | 31.9,2.79 27.99,2.79 27.01,1.81 v17.78,1.81 | U8.2 21.31,19.77 v21.45,19.92 | U7.8 19,22.95 18.86,23.09 v18.86,23.43 | v23.96,26.54 24.57,26.54 25.02,26.99 25.02,28.7 23.25,30.48 23.25,30.73 | 23.25,30.73 v23.25,31.53 | C11.2 11.7,11.19 11.68,11.18 | 17.78,5.46 19.94,5.46 21.71,7.24 U11.9 | 57.78,11.18 57.78,9.53 57.02,8.76 57.02,6.73 | v45.97,4.6 45.47,5.1 U25.9 45.47,7.5 U25.EP 44.47,9 U25.24 | v10.29,24.38 10.31,24.36 10.31,22.74 9.87,22.29 Q3.2 | C5.2 23.25,30.73
  Top 0.203: 36.77,14.59 36.77,14.3 36.35,13.89 36.35,13.11 36.07,12.83 35.69,12.83 | 35.69,12.83 34.01,12.83 33.78,13.05 33.78,13.15 32.76,14.18 32.76,14.45 | C10.2 35.7,12.84 35.69,12.83
  Top 0.254: 5.08,16.16 U16.2 5.08,13.35 5.22,13.21 C14.2 | 5.08,16.16 5.08,18.24 5.21,18.37 | 5.08,16.16 6.1,16.16 6.62,15.63 7.8,15.63 8.3,15.14 8.3,14.47 8.05,14.22 8.05,13.24 9.63,11.67 9.63,11.3 9.76,11.18 11.68,11.18 12.45,11.18 12.95,11.68 13.97,11.68 | U19.2 U19.3 | C15.2 29.23,12.57 29.08,12.71 U19.2 | U20.3 U20.2 29.08,15.49 U19.2 | U22.2 53.34,16.16 U23.2 U23.3 | U22.2 U22.3 | 33.66,22.23 C18.2 | v30.23,26.67 31.08,26.67 32.39,25.36 36.55,25.36 v36.68,25.23 38.68,25.23 38.99,25.54 v38.99,28.83 | v23.96,26.54 23.83,26.54 23.2,25.91 19.88,25.91 18.54,27.24 C4.2 C3.2 C2.2 12.51,27.24 12.32,27.43 v12.32,29.21 12.32,32 | U1.3 12.32,32 | D1.1 D2.1 | D3.1 D4.1 35.51,15.73 J2.3 | C19.2 62.93,19.46 60.07,19.46 | U6.2 27.97,23.27 v28.32,23.62 28.92,24.22 U6.5 | 13.97,11.68 13.97,11.18 17.78,7.37 17.78,5.46 v17.78,1.81 | 13.97,11.68 13.97,13.73 | v38.86,14.73 R23.1 | C9.2 59.7,11.22 59.69,11.21 | U11.9 25.53,7.24 25.91,6.86 | U22.2 53.34,13.34 53.47,13.21 C16.2 | 12.32,33.53 12.32,33.91 12.57,34.16 C1.2 | 12.32,33.53 8.51,33.53 8.18,33.86 6.85,33.86 6.48,33.48 U26.9 6.47,30.73 U26.EP | 12.32,32 12.32,33.53 | Q1.2 Q2.2 Q3.2 | U26.18 4.7,29.23 4.71,29.23 4.98,29.23 U26.EP | U26.23 6.97,29.73 U26.EP | U5.2 60.33,21.21 60.07,20.95 60.07,19.46 | C20.2 57.7,19.46 60.07,19.46
  Top 0.305: 36.83,21.34 39.44,21.34 40.01,21.91 C17.2 | v36.83,20.7 36.83,21.34 | C19.2 63.12,18.64 62.48,18 62.48,16.36 63.37,15.48 63.37,14.53 63.19,14.35 62.61,14.35 | D1.1 12.5,14 J1.3 13.97,13.73 14.62,13.73 15.11,14.22 15.11,14.86 | D6.1 D5.1 60.62,13.88 | 60.62,13.88 J3.3 60.77,11.77 60.21,11.21 59.69,11.21 58.91,11.21 58.88,11.18 57.78,11.18 56.41,11.18 54.86,12.73 54.86,14.26 54.69,14.43 U22.3 | 60.62,13.88 61.1,14.35 62.61,14.35 | R24.1 62.61,14.35 | 15.11,14.86 15.11,16.64 13.97,17.78 13.97,20.07 | R13.1 15.1,14.84 15.11,14.86 | U4.2 37.21,22.99 36.83,22.61 36.83,21.34 | C18.2 34.33,21.34 36.83,21.34 | 13.97,22.48 U3.2 13.34,22.48 13.01,22.15 13.01,20.95 | C13.2 13.01,20.95 | 13.01,20.95 13.02,20.95 13.84,20.95 13.97,20.82 13.97,20.07 | C12.2 15.65,20.07 13.97,20.07
  Top 0.406: J4.1 v31.88,29.97 | C7.2 42.26,28.83 v38.99,28.83
  Bottom 0.152: v23.23,33.02 23.23,31.55 v23.25,31.53 | v45.97,4.6 56.99,4.6 v57.01,4.57
  Bottom 0.2: v21.45,19.92 21.45,21.09 20.07,22.48 18.8,22.48 | 16.77,23.11 17.4,22.48 18.8,22.48 | v18.86,23.43 18.86,22.54 18.8,22.48 | v12.32,29.21 12.32,27.98 13.05,27.25 13.05,24.7 12.62,24.27 11.62,24.27 11.26,24.64 10.54,24.64 v10.29,24.38
  Bottom 0.254: v17.78,1.81 6.36,1.81 v6.16,2.01 | v38.86,14.73 37.77,14.73 J2.3
  Bottom 0.305: J2.3 37.97,16.94 37.97,20.02 37.29,20.7 v36.83,20.7 36.68,20.85 v36.68,25.23 | J3.3 60.77,15.56 61.97,16.77 61.97,17.77 54.2,25.54 40.37,25.54 38.99,26.92 v38.99,28.83 | 28,26.54 v23.96,26.54 23.78,26.54 23.34,26.11 22.88,26.11 22.73,26.26 19.93,26.26 16.77,23.11 15.43,21.77 14.14,21.77 13.97,21.6 13.97,16.77 12.77,15.56 J1.3 | v30.23,26.67 30.1,26.54 28,26.54 | 28,26.54 28,23.94 v28.32,23.62
  Bottom 0.406: v38.99,28.83 37.85,29.97 v31.88,29.97
  pour Top (rank 3, no thermals): 56.26,32.89 47.5,32.89 43.81,29.21 42.04,29.21 41.91,29.08 41.91,27.3 42.16,27.05 45.85,27.05 46.74,26.16 46.74,24.64 47.24,24.13 48.64,24.13 48.9,24.38 48.9,28.19 49.66,28.96 49.66,29.72 50.67,30.73 56.26,30.73 56.64,31.11 56.64,32.51
GPIOA  (via drill 0.2)
  Top 0.152: v37.73,27.18 38.12,27.57 J4.6 | v10.95,24.16 10.95,24.59 10.36,25.18 10.36,26.92 10.11,27.18 R29.1 9.07,27.18 8.82,27.43 8.82,27.72 8.69,27.86 6.56,27.86 6.47,27.94 U26.22
  Bottom 0.152: v37.73,27.18 37.26,27.18 35.78,28.65 25.32,28.65 24.16,29.82 19.9,29.82 14.02,23.93 11.18,23.93 v10.95,24.16
GPIOB  (via drill 0.2)
  Top 0.152: v37.08,25.91 36.88,26.12 J4.5 | U25.22 45.47,12.81 45.2,13.08 43.56,13.08 | R28.1 43.56,13.08 | 43.56,13.08 v43.56,14.34
  Bottom 0.152: v37.08,25.91 37.26,25.73 37.26,21.33 38.33,20.26 38.33,15.91 39.9,14.34 v43.56,14.34
LOAD  (via drill 0.2)
  Top 0.152: U10.13 11.27,4.06 11.86,4.65 v11.86,6.81 | U9.13 12.31,9.14 v14.22,7.23 | U13.13 37.44,4.06 v38.15,4.77 38.15,6.29 v37.64,6.8 | v63.25,4.06 v63.24,4.06 U15.13 | U12.13 38.23,9.14 39.45,7.93 v39.45,4.77 39.45,2.12 v39.5,2.07 | U14.13 63.11,9.14 63.18,9.07 63.83,9.07 v64.52,8.38 | v44.32,1.91 44.32,4.76 44.47,4.91 U25.7
  Bottom 0.152: v11.86,6.81 12.29,7.23 v14.22,7.23 14.36,7.36 20.63,7.36 20.77,7.23 21.28,7.23 21.55,7.49 26.39,7.49 31.11,7.49 31.37,7.24 33.12,7.24 33.17,7.29 37.15,7.29 v37.64,6.8 | v39.5,2.07 39.62,2.19 44.03,2.19 v44.32,1.91 44.54,1.69 60.87,1.69 v63.25,4.06 64.52,5.33 v64.52,8.38 | v39.45,4.77 v38.15,4.77
MUX_EN  (via drill 0.2)
  Top 0.152: 20.63,25.01 20.63,24.63 20.68,24.57 U7.6 | 20.63,25.01 21.1,25.48 R6.1 | 20.63,25.01 20.21,25.01 19.16,23.96 18.64,23.96 17.15,25.46 12.47,25.46 11.99,25.94 v11.37,25.94 | v4.19,32.78 4.19,32.27 4.27,32.19 U26.13
  Bottom 0.152: v11.37,25.94 10.87,25.94 4.19,32.61 v4.19,32.78
MUX_SEL0  (via drill 0.2)
  Top 0.152: U7.10 19.63,21.4 19.37,21.15 R7.1 19.37,19.75 19.18,19.56 17.78,19.56 17.6,19.74 17.6,24.1 16.8,24.9 13.22,24.9 12.76,24.45 12.38,24.45 12.12,24.71 12.12,24.86 v11.95,25.03 | v5.97,33.39 U26.10
  Bottom 0.152: v5.97,33.39 12.45,26.91 12.45,25.53 v11.95,25.03
MUX_SEL1  (via drill 0.2)
  Top 0.152: v12.57,24.9 12.85,25.18 16.92,25.18 18.28,23.82 18.28,22.48 | v5.33,33.4 5.47,33.26 U26.11 | R8.1 18.28,22.48 | U7.9 18.3,22.45 18.28,22.48
  Bottom 0.152: v12.57,24.9 12.24,24.57 11.75,24.57 11.41,24.92 11.41,25.25 12.17,26.01 12.17,26.55 5.33,33.38 v5.33,33.4
MUX_SEL2  (via drill 0.2)
  Top 0.152: v18.83,24.42 17.52,25.74 12.58,25.74 11.71,26.61 v11.46,26.61 | v4.7,33.41 4.7,33.34 4.97,33.06 U26.12
  Top 0.2: 22.41,18.92 22.41,18.55 21.96,18.1 U8.6 | 22.41,18.92 22.41,19.48 v22.54,19.61 | R9.1 22.44,18.89 22.41,18.92
  Bottom 0.152: v22.54,19.61 21.89,20.26 21.89,21.3 18.83,24.36 v18.83,24.42 | v11.46,26.61 10.95,26.61 4.7,32.87 v4.7,33.41
N$1  (via drill 0.2)
  Top 0.152: U7.3 22.18,24.81 v22.1,24.89 | U8.3 20.66,18.46 20.95,18.16 v21.16,18.16
  Bottom 0.152: v22.1,24.89 23.32,23.67 24.18,23.67 24.7,23.15 24.7,22.27 23.42,20.99 23.42,18.77 22.81,18.16 v21.16,18.16
N$2
  Top 0.254: R10.2 49.82,28.86 50.63,29.68 U28.6
N$3
  Top 0.254: U28.5 51.4,27.37 R12.1 51.23,25.29 C21.2 R11.2
N$4
  Top 0.152: U10.11 11.06,3.06 12.45,4.45 12.45,6.87 12.02,7.29 9.32,7.29 9.25,7.22 U9.9
N$5
  Top 0.152: U13.11 38.11,3.06 38.61,3.56 38.61,6.48 37.79,7.29 35.25,7.29 U12.9
N$6
  Top 0.152: U14.9 63.91,7.09 64.46,6.54 64.46,3.63 63.88,3.05 62.31,3.05 U15.11
N$7
  Top 0.2: R22.1 8.24,24.61 Q3.3
N$8
  Top 0.152: U21.2 27.56,16.64 27.63,16.71 27.63,18.93 28.13,19.43 U20.5
N$9
  Top 0.2: U19.5 28.13,16.34 27.78,15.99 U21.1
N$10
  Top 0.152: U18.1 4.1,17.16 U16.5
N$11
  Top 0.152: U18.2 3.5,17.81 3.63,17.94 3.63,19.22 4.13,19.72 U17.5
N$12
  Top 0.152: U24.2 51.76,17.43 51.89,17.56 51.89,19.29 52.39,19.79 U23.5
N$13
  Top 0.254: U22.5 52.01,17.13 51.66,16.78 U24.1
N$14
  Top 0.2: R21.1 4.94,24.61 Q2.3
N$15
  Top 0.2: R20.1 1.64,24.61 Q1.3
N$16  (via drill 0.2)
  Top 0.152: R14.1 1.25,14.84 v1.52,15.11 | v1.02,17.78 0.95,17.84 U18.4
  Bottom 0.152: v1.52,15.11 1.52,17.27 v1.02,17.78
N$17
  Top 0.152: R15.1 25.39,14.1 24.38,15.1 24.38,16.26 25.09,16.96 U21.4
N$18
  pour Top (rank 2, no thermals): 46.1,34.54 45.85,34.29 45.85,30.86 45.97,30.73 47.24,30.73 47.37,30.86 47.37,34.29 47.12,34.54
N$19
  Top 0.152: R19.1 50.94,13.74 48.59,16.1 48.59,17.05 49.22,17.68 U24.4
N$38
  Top 0.152: U8.1 21.96,20.07 21.68,20.34 U7.13
OD1  (via drill 0.2)
  Top 0.152: v48.87,12.04 48.87,11.99 48.95,11.91 48.95,7.94 48.5,7.5 U25.15
  Top 0.2: C11.1 9.91,12.06 9.23,12.74 J1.2
  Top 0.254: J1.2 9.23,14.93 7.86,16.3 R16.1 7.24,16.92 7.03,17.13 U16.4
  Top 0.305: D2.2 9.85,13.11 J1.2
  Bottom 0.152: J1.2 11.1,11.87 23.52,11.87 23.82,12.16 26.82,12.16 26.99,12 32.28,12 32.52,11.76 35.74,11.76 36.02,12.04 36.63,12.04 36.8,11.86 48.69,11.86 v48.87,12.04
OD2  (via drill 0.2)
  Top 0.152: v47.5,14.41 47.75,14.15 47.75,13.09 48.34,12.51 48.34,9.97 48.67,9.64 48.67,8.39 48.27,8 U25.16
  Top 0.203: C10.1 33.91,13.59 33.24,14.25 33.24,15.72
  Top 0.254: U19.4 31.5,16.46 | 31.5,16.46 32.5,16.46 J2.2 33.24,15.72 33.34,15.62 D4.2 | R17.1 31.5,16.46
  Bottom 0.152: J2.2 33.58,15.38 33.58,14.42 34.22,13.78 44.2,13.78 44.83,14.4 v47.49,14.4 v47.5,14.41
OD3  (via drill 0.2)
  Top 0.152: v47.88,12.32 47.88,10.03 48.39,9.53 48.39,8.64 48.25,8.5 U25.17
  Top 0.254: U22.4 54.29,16.48 54.61,16.16 54.82,16.16 55.56,15.41 R18.1 55.74,15.41 57.23,13.92 J3.2 | C9.1 57.77,11.94 57.23,12.48 J3.2 | D6.2 57.98,12.99 J3.2
  Bottom 0.152: v47.88,12.32 48.5,12.32 48.68,12.49 49.06,12.49 49.23,12.32 55.82,12.32 J3.2
OUT1  (via drill 0.2)
  Top 0.152: v14.96,6.91 14.55,6.91 14.41,6.77 14.04,6.77 12.67,8.14 U9.11 | v41.78,8.08 42.7,9 U25.1 | v2.54,12.19 2.54,13.19 R14.2
  Bottom 0.152: v41.78,8.08 41.78,7.24 40.89,6.34 37.04,6.34 36.87,6.17 36.65,6.17 36.09,6.73 33.4,6.73 33.3,6.63 32.22,6.63 31.79,6.2 23.54,6.2 22.66,7.08 21.54,7.08 21.36,6.91 v14.96,6.91 14.18,6.12 11.78,6.12 11.33,6.57 11.33,6.74 11.06,7.01 6.33,7.01 2.54,10.8 v2.54,12.19
OUT2  (via drill 0.2)
  Top 0.152: U12.11 38.1,8.14 v38.97,7.27 | U25.2 42.91,8.5 41.94,7.53 v41.28,7.53 40.82,7.53 35.9,12.45 33.86,12.45 33.48,12.83 33.48,13.03 32.7,13.8 31.45,13.8 31.11,13.46 31.11,12.01 30.33,11.23 28.65,11.23 27.3,12.57 R15.2
  Bottom 0.152: v41.28,7.53 39.22,7.53 v38.97,7.27
OUT3  (via drill 0.2)
  Top 0.152: v63.12,8.13 62.31,8.13 U14.11 | v42.26,7.17 42.26,7.45 42.81,8 U25.3 | v49.15,7.04 49.64,7.53 R19.2
  Bottom 0.152: v63.12,8.13 61.91,6.91 49.28,6.91 v49.15,7.04 49.02,7.17 v42.26,7.17
PORT1_EN
  Top 0.152: U26.2 9.01,29.73 10.92,27.82 10.92,25.41 12.84,23.5 13.72,23.5 13.78,23.43 U3.3
PORT2_EN  (via drill 0.2)
  Top 0.152: v19.89,25.35 18.95,26.3 12.94,26.3 11.94,27.3 11.94,28.19 9.4,30.73 U26.4 | v26.55,25.76 26.93,26.14 29.6,26.14 29.95,25.79 31.01,25.79 32.06,24.74 36.09,24.74 36.36,24.47 36.9,23.94 U4.3
  Bottom 0.152: v19.89,25.35 20.45,25.91 22.58,25.91 22.73,25.76 23.49,25.76 v26.55,25.76
PORT3_EN  (via drill 0.2)
  Top 0.152: v10.66,31.89 10.5,31.73 U26.6 | v60.07,24.51 60.07,24 61.42,22.65 U5.3
  Bottom 0.152: v60.07,24.51 59.89,24.69 59.89,24.83 57.9,26.82 43.04,26.82 35.95,33.91 12.68,33.91 v10.66,31.89
SCL  (via drill 0.2)
  Top 0.127: v32.51,13.35 32.51,12.66 30.6,10.74 30.6,6.92 29.41,5.74 U11.19
  Top 0.152: R2.1 24,31.99 U2.2 | U6.1 28.22,24.22 28.72,24.72 30.39,24.72 31.75,23.36 v31.75,23.24 | v46.86,13.46 46.97,13.36 U25.19 | U26.19 4.97,27.83 v4.7,27.56
  Top 0.2: R2.1 24.13,31.24 24.71,30.66 27.93,30.66 28.38,30.22 28.38,27.68 28.75,27.3 31.03,27.3 32.47,25.87 v32.85,25.87 32.88,25.84 33.85,25.84 v33.98,25.97 34.98,25.97 35.62,26.61 J4.4
  Bottom 0.152: v33.98,25.97 33.98,25.33 31.88,23.24 v31.75,23.24 29.48,20.96 29.48,16.38 v32.51,13.35 32.64,13.22 44.44,13.22 45.06,13.84 46.48,13.84 v46.86,13.46 | v32.85,25.87 31.77,25.87 30.32,27.33 26.52,27.33 26.26,27.07 23.52,27.07 23.44,27.15 19.68,27.15 15.03,22.51 8.61,22.51 4.7,26.42 v4.7,27.56
SCL_HV
  Top 0.152: U2.7 20.32,32.39 19.7,33 U1.10
SDA  (via drill 0.2)
  Top 0.127: v31.62,13.28 31.62,12.14 30.35,10.86 30.35,7.03 29.55,6.24 U11.20
  Top 0.152: R1.1 25.25,32.12 24.68,32.7 23.55,32.7 23.25,32.39 U2.3 | U6.3 28.6,22.32 29.11,22.82 30.44,22.82 v30.8,23.18 | v46.22,13.34 46.47,13.09 U25.20 | v5.41,27.53 5.47,27.6 U26.20
  Top 0.2: R1.1 25.27,31.5 25.78,30.99 28.19,30.99 28.7,30.48 28.7,27.81 28.88,27.63 31.3,27.63 32.51,26.42 v33.4,26.42 33.78,26.42 34.38,27.01 J4.3
  Bottom 0.152: v5.41,27.53 5.41,26.64 9.27,22.79 14.79,22.79 19.43,27.43 23.56,27.43 23.64,27.35 26.03,27.35 26.29,27.61 30.43,27.61 31.63,26.42 v33.4,26.42 33.4,25.53 33.04,25.16 32.78,25.16 v30.8,23.18 29.11,21.5 29.11,15.79 v31.62,13.28 31.93,13.28 32.32,12.89 44.5,12.89 44.95,13.34 v46.22,13.34
SDA_HV
  Top 0.152: U2.6 20.31,32.79 19.72,33.38 17.76,33.38 17.65,33.27 17.65,32.77 17.91,32.5 U1.9
VMUX  (via drill 0.2)
  Top 0.2: R6.2 24.08,24.18 24.77,23.5 24.77,22.48 | 24.77,22.48 24.77,21.69 v23.88,20.8 | v22.99,16.51 22.99,17.57 R9.2 | U7.16 23.26,22.48 24.77,22.48 | R8.2 R7.2 19.37,18.34 20.06,17.65 21.08,17.65 21.31,17.43 U8.5
  Top 0.305: U8.5 21.31,16.29 21.46,16.13 22.48,16.13 | 22.48,16.13 22.61,16.13 v22.99,16.51 | D7.3 22.48,14.73 22.48,16.13
  Bottom 0.2: v23.88,20.8 23.88,17.4 v22.99,16.51
VPORT1_IN  (via drill 0.2)
  Top 0.152: U7.12 21.18,20.29 20.87,19.98 v20.79,19.98
  Top 0.254: v19.94,16.51 18.68,16.51
  Top 0.305: S1.2 18.68,16.51 18.68,16.8 16.89,18.58 16.89,20.85 16.62,21.12 15.75,21.12 | 14.32,21.53 U3.1 14.3,21.53 14.71,21.12 15.75,21.12 | C12.1 15.75,21.12
  Bottom 0.152: v20.79,19.98 20.79,18.83 19.94,17.98 v19.94,16.51
VPORT1_OUT  (via drill 0.2)
  Top 0.152: U7.1 v24.12,22.96
  Top 0.305: J1.1 9.23,20.79 9.97,21.53 U3.5 11.31,21.49 C13.1
  Bottom 0.152: v24.12,22.96 23.05,21.9 23.05,19.18 22.49,18.62 20.97,18.62 20.6,18.25 20.6,15.13 18.05,12.58 12.07,12.58 11.64,13.01 11.64,14.54 12.13,15.03 12.13,15.97 10.83,17.27 J1.1
VPORT2_IN
  Top 0.152: U7.14 22.18,20.36 22.48,20.07 24.27,20.07 25.39,21.18 25.39,25.35 26.58,26.54 29.59,26.54 30.06,26.07 31.13,26.07 32.18,25.02 36.21,25.02 36.48,24.75 40.02,24.75 40.13,24.64 C17.1
  Top 0.305: S2.2 42.68,22.22 41.09,23.81 C17.1 39.3,23.81 38.99,23.5 38.99,22.23 38.8,22.04 U4.1
VPORT2_OUT  (via drill 0.2)
  Top 0.152: v25.84,24.38 26.46,25 30.75,25 32.51,23.24 32.85,23.24 | v21.08,24.82 21.18,24.72 U7.5
  Top 0.305: J2.1 32.85,19.65 32.85,23.24 32.85,23.45 33.11,23.71 C18.1 34.37,23.71 35.35,22.73 U4.5
  Bottom 0.152: v21.08,24.82 21.61,25.35 22.35,25.35 23.32,24.38 v25.84,24.38
VPORT3_IN  (via drill 0.2)
  Top 0.152: v27.18,29.84 27.18,27.53 25.08,25.44 25.08,21.27 24.16,20.34 22.99,20.34 22.68,20.65 U7.15 | v62.99,23.37 63.12,23.24 C19.1
  Top 0.305: 62.82,21.26 C19.1 | C19.1 64.17,21.56 64.39,21.34 64.39,19.05 63.04,17.7 63.04,16.63 64.27,15.4 S3.2 | 62.97,21.56 C19.1 | U5.1 61.67,20.26 62.03,20.61 62.99,20.61 63.12,20.74 C19.1
  Bottom 0.152: v62.99,23.37 58.17,23.37 55.37,26.18 42.79,26.18 38.18,30.78 27.86,30.78 27.18,30.1 v27.18,29.84
VPORT3_OUT  (via drill 0.2)
  Top 0.152: v27.77,30.04 27.51,30.3 26.73,30.3 26.01,29.57 26.01,26.76 24.7,25.45 24.7,25.04 24.43,24.77 22.86,24.77 22.68,24.59 U7.2 | v57.15,23.5 C20.1
  Top 0.305: J3.1 56.26,18.24 56.26,21.51 56.46,21.71 C20.1 57.84,21.71 58.72,20.83 U5.5
  Bottom 0.152: v57.15,23.5 54.75,25.9 42.67,25.9 38.07,30.5 28.23,30.5 v27.77,30.04

## Text on the board
tDocu: Talon - Aux / v1.5 / Bobby Schulz | GEMS Sensing | Port2 | 5V | Port1 | 5V | Port3 | 5V | 3V3 | 3V3 | 3V3
bDocu: SN